# Altium project REGENIX (1).PrjPCB (part 2 of 2)

## Sheet REGENIX_Relais_24V_1.SchDoc
size Tabloid; Date: Date; Author: Author 1; DocumentNumber: 2; Revision: 1; SheetNumber: 14; SheetTotal: 17; Size: 11x17; Sheet_Name: BATTERY PROTECTION & AUXILIARY
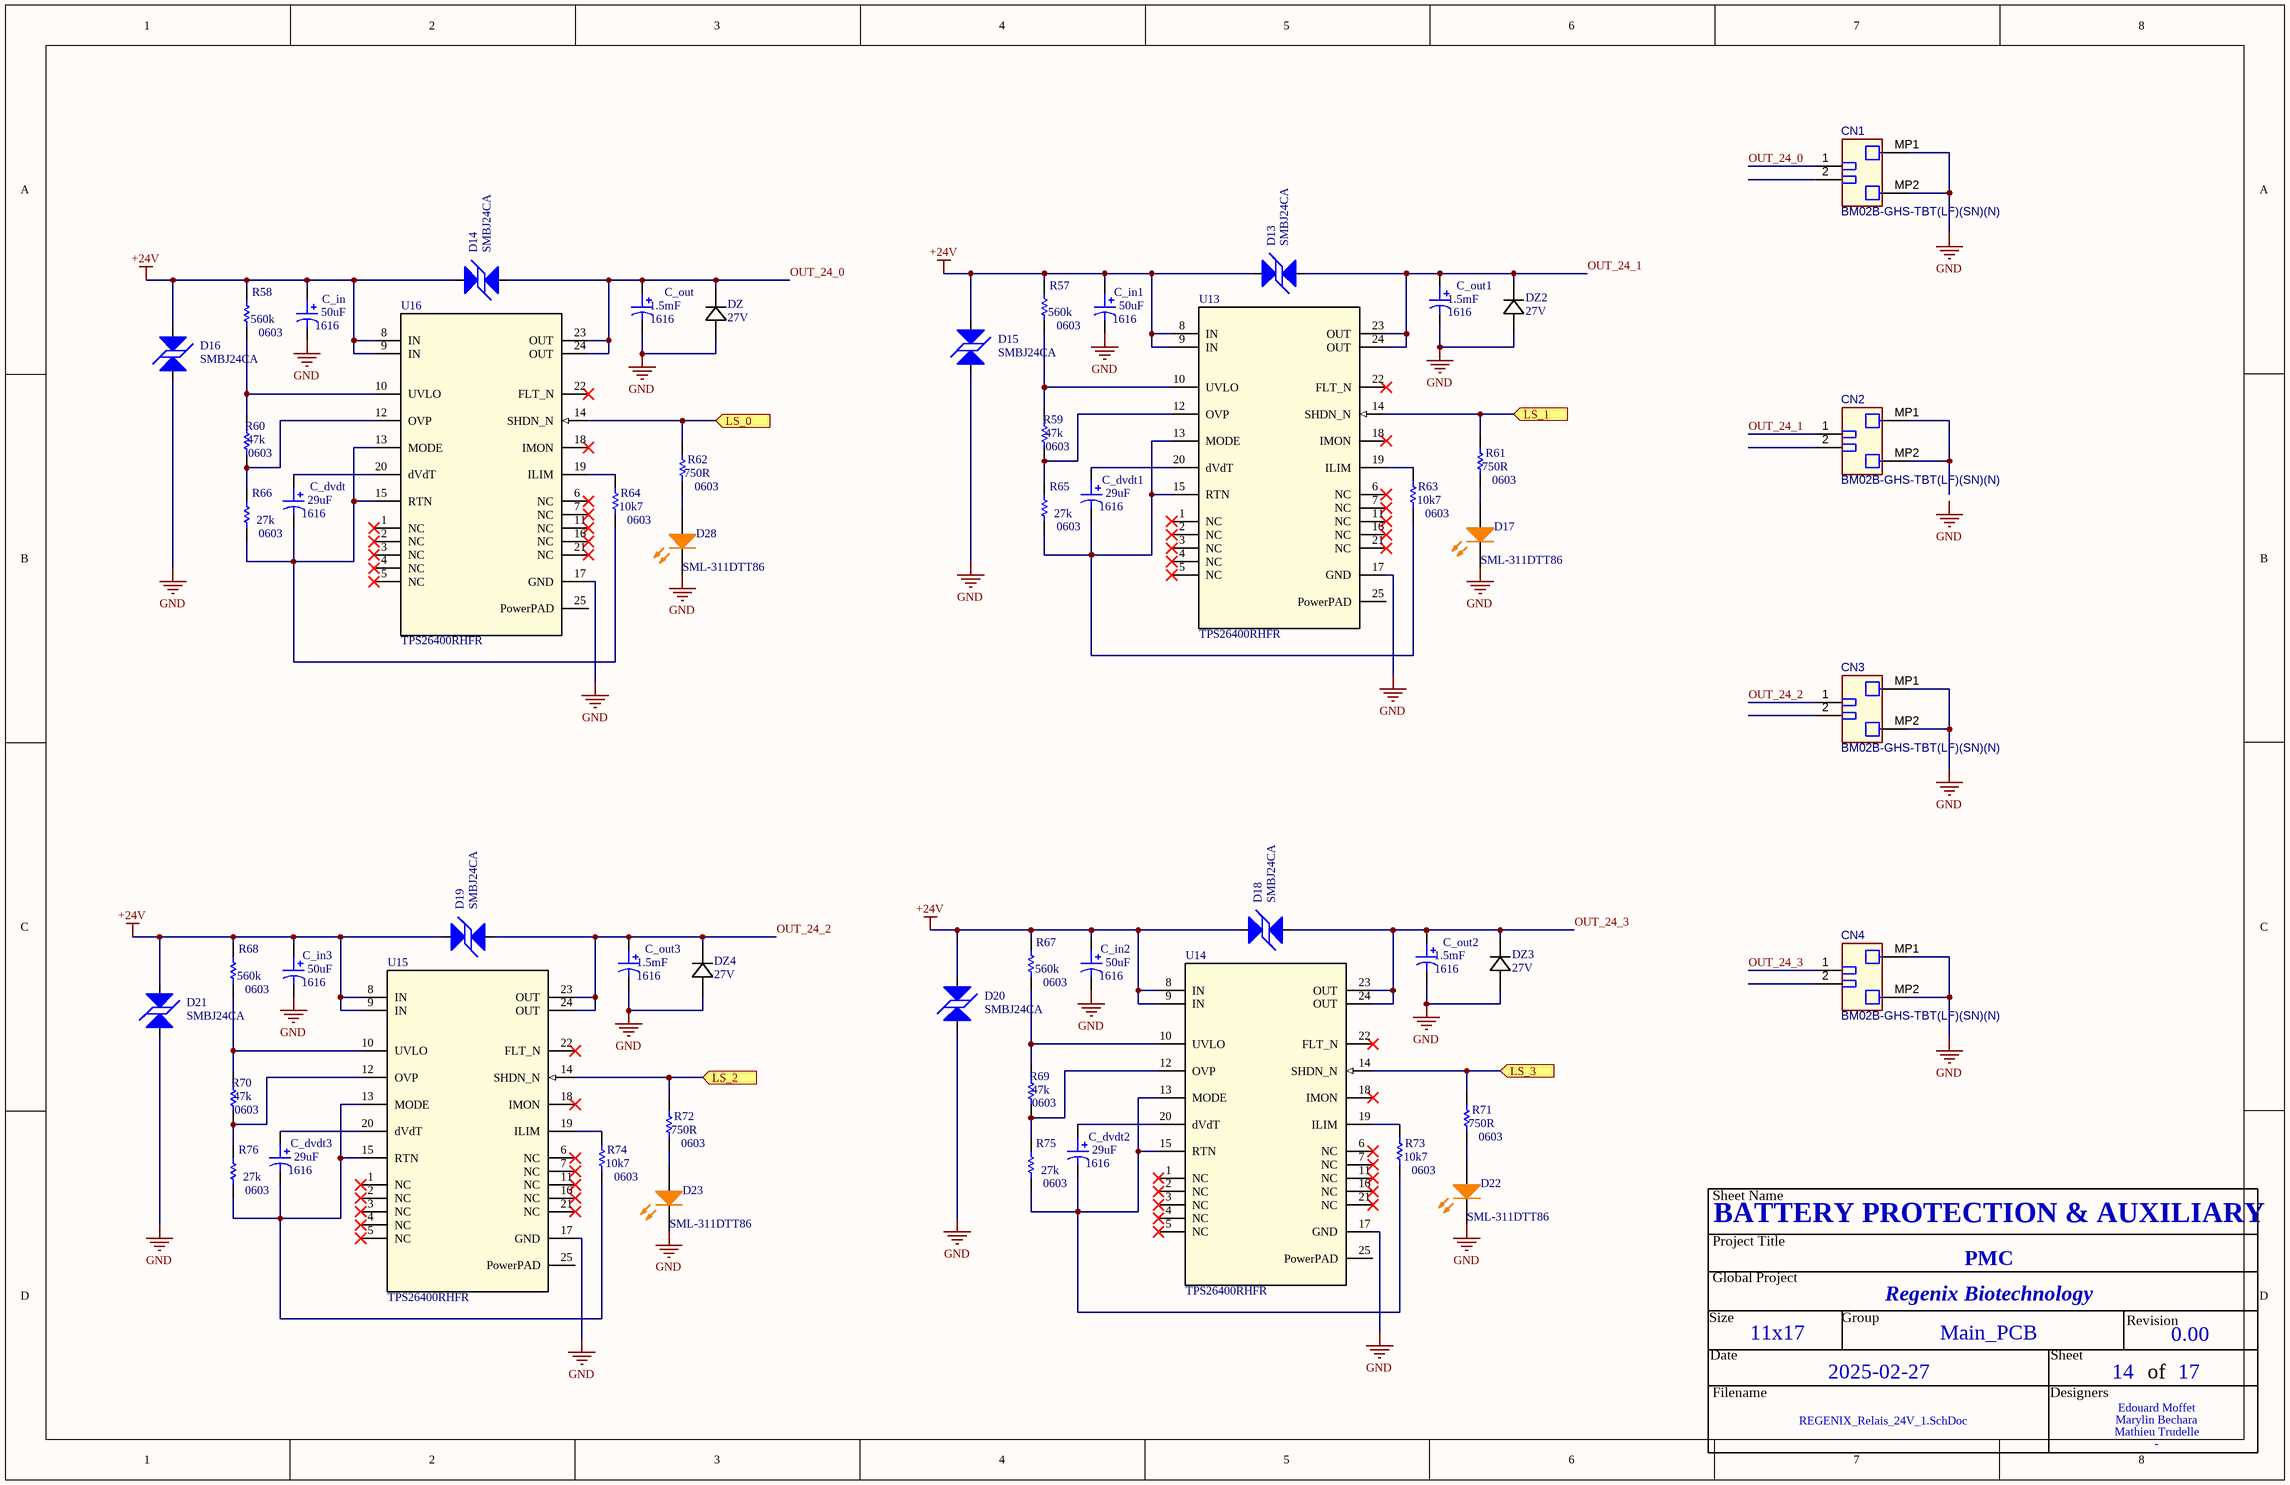
[diagram p11: REGENIX_Relais_24V_1.SchDoc]

### Parts
(Parts that share a designator on the sheet are numbered #1, #2 ... from top to bottom, then left to right.)
C_dvdt1  value 29uF  Package: 1616  [CAP_ALU_1616_vishay]  (hidden comment: MAL214699108E3)
C_dvdt2  value 29uF  Package: 1616  [CAP_ALU_1616_vishay]  (hidden comment: MAL214699108E3)
C_dvdt3  value 29uF  Package: 1616  [CAP_ALU_1616_vishay]  (hidden comment: MAL214699108E3)
C_dvdt#2  value 29uF  Package: 1616  [CAP_ALU_1616_vishay]  (hidden comment: MAL214699108E3)
C_in1  value 50uF  Package: 1616  [CAP_ALU_1616_vishay]  (hidden comment: MAL214699108E3)
C_in2  value 50uF  Package: 1616  [CAP_ALU_1616_vishay]  (hidden comment: MAL214699108E3)
C_in3  value 50uF  Package: 1616  [CAP_ALU_1616_vishay]  (hidden comment: MAL214699108E3)
C_in#2  value 50uF  Package: 1616  [CAP_ALU_1616_vishay]  (hidden comment: MAL214699108E3)
C_out1  value 1.5mF  Package: 1616  [CAP_ALU_1616_vishay]  (hidden comment: MAL214699108E3)
C_out2  value 1.5mF  Package: 1616  [CAP_ALU_1616_vishay]  (hidden comment: MAL214699108E3)
C_out3  value 1.5mF  Package: 1616  [CAP_ALU_1616_vishay]  (hidden comment: MAL214699108E3)
C_out#2  value 1.5mF  Package: 1616  [CAP_ALU_1616_vishay]  (hidden comment: MAL214699108E3)
CN1  BM02B-GHS-TBT(LF)(SN)(N)  [JST-BM02B-GHS-TBT_V]
CN2  BM02B-GHS-TBT(LF)(SN)(N)  [JST-BM02B-GHS-TBT_V]
CN3  BM02B-GHS-TBT(LF)(SN)(N)  [JST-BM02B-GHS-TBT_V]
CN4  BM02B-GHS-TBT(LF)(SN)(N)  [JST-BM02B-GHS-TBT_V]
D13  SMBJ24CA  [TVS_PWR_SMBJ36CA]
D14  SMBJ24CA  [TVS_PWR_SMBJ36CA]
D15  SMBJ24CA  [TVS_PWR_SMBJ36CA]
D16  SMBJ24CA  [TVS_PWR_SMBJ36CA]
D17  SML-311DTT86  [LED_0603]
D18  SMBJ24CA  [TVS_PWR_SMBJ36CA]
D19  SMBJ24CA  [TVS_PWR_SMBJ36CA]
D20  SMBJ24CA  [TVS_PWR_SMBJ36CA]
D21  SMBJ24CA  [TVS_PWR_SMBJ36CA]
D22  SML-311DTT86  [LED_0603]
D23  SML-311DTT86  [LED_0603]
D28#2  SML-311DTT86  [LED_0603]
DZ2  27V  [SOD123_DIO]
DZ3  27V  [SOD123_DIO]
DZ4  27V  [SOD123_DIO]
DZ#2  27V  [SOD123_DIO]
R57  Package: 0603  Precision: 560k  [RES_0603]  (hidden comment: RES - 0603)
R58  Package: 0603  Precision: 560k  [RES_0603]  (hidden comment: RES - 0603)
R59  Package: 0603  Precision: 47k  [RES_0603]  (hidden comment: RES - 0603)
R60  Package: 0603  Precision: 47k  [RES_0603]  (hidden comment: RES - 0603)
R61  Package: 0603  Precision: 750R  [RES_0603]  (hidden comment: RES - 0603)
R62  Package: 0603  Precision: 750R  [RES_0603]  (hidden comment: RES - 0603)
R63  Package: 0603  Precision: 10k7  [RES_0603]  (hidden comment: RES - 0603)
R64  Package: 0603  Precision: 10k7  [RES_0603]  (hidden comment: RES - 0603)
R65  Package: 0603  Precision: 27k  [RES_0603]  (hidden comment: RES - 0603)
R66  Package: 0603  Precision: 27k  [RES_0603]  (hidden comment: RES - 0603)
R67  Package: 0603  Precision: 560k  [RES_0603]  (hidden comment: RES - 0603)
R68  Package: 0603  Precision: 560k  [RES_0603]  (hidden comment: RES - 0603)
R69  Package: 0603  Precision: 47k  [RES_0603]  (hidden comment: RES - 0603)
R70  Package: 0603  Precision: 47k  [RES_0603]  (hidden comment: RES - 0603)
R71  Package: 0603  Precision: 750R  [RES_0603]  (hidden comment: RES - 0603)
R72  Package: 0603  Precision: 750R  [RES_0603]  (hidden comment: RES - 0603)
R73  Package: 0603  Precision: 10k7  [RES_0603]  (hidden comment: RES - 0603)
R74  Package: 0603  Precision: 10k7  [RES_0603]  (hidden comment: RES - 0603)
R75  Package: 0603  Precision: 27k  [RES_0603]  (hidden comment: RES - 0603)
R76  Package: 0603  Precision: 27k  [RES_0603]  (hidden comment: RES - 0603)
U13  TPS26400RHFR  [RHF0024A-IPC_A]
U14  TPS26400RHFR  [RHF0024A-IPC_A]
U15  TPS26400RHFR  [RHF0024A-IPC_A]
U16#2  TPS26400RHFR  [RHF0024A-IPC_A]

### Ports
LS_0 (in), LS_1 (in), LS_2 (in), LS_3 (in)

### Nets
+24V: C_in1.1 C_in2.1 C_in3.1 C_in#2.1 D13.1 D14.1 D15.1 D16.1 D18.1 D19.1 D20.1 D21.1 R57.2 R58.2 R67.2 R68.2 U13.8(IN) U13.9(IN) U14.8(IN) U14.9(IN) U15.8(IN) U15.9(IN) U16#2.8(IN) U16#2.9(IN)
GND: C_in1.2 C_in2.2 C_in3.2 C_in#2.2 C_out1.2 C_out2.2 C_out3.2 C_out#2.2 CN1.MP1 CN1.MP2 CN3.MP1 CN3.MP2 CN4.MP1 CN4.MP2 D15.2 D16.2 D17.K D20.2 D21.2 D22.K D23.K D28#2.K DZ2.2 DZ3.2 DZ4.2 DZ#2.2 U13.17(GND) U14.17(GND) U15.17(GND) U16#2.17(GND)
LS_0: R62.2 U16#2.14(SHDN_N) ; port LS_0
LS_1: R61.2 U13.14(SHDN_N) ; port LS_1
LS_2: R72.2 U15.14(SHDN_N) ; port LS_2
LS_3: R71.2 U14.14(SHDN_N) ; port LS_3
OUT_24_0: C_out#2.1 CN1.1 D14.2 DZ#2.1 U16#2.23(OUT) U16#2.24(OUT)
OUT_24_1: C_out1.1 CN2.1 D13.2 DZ2.1 U13.23(OUT) U13.24(OUT)
OUT_24_2: C_out3.1 CN3.1 D19.2 DZ4.1 U15.23(OUT) U15.24(OUT)
OUT_24_3: C_out2.1 CN4.1 D18.2 DZ3.1 U14.23(OUT) U14.24(OUT)
NetC_dvdt1_1: C_dvdt1.1 U13.20(dVdT)
NetC_dvdt1_2: C_dvdt1.2 R63.1 R65.1 U13.13(MODE) U13.15(RTN)
NetC_dvdt2_1: C_dvdt2.1 U14.20(dVdT)
NetC_dvdt2_2: C_dvdt2.2 R73.1 R75.1 U14.13(MODE) U14.15(RTN)
NetC_dvdt3_1: C_dvdt3.1 U15.20(dVdT)
NetC_dvdt3_2: C_dvdt3.2 R74.1 R76.1 U15.13(MODE) U15.15(RTN)
NetC_dvdt#2_1: C_dvdt#2.1 U16#2.20(dVdT)
NetC_dvdt#2_2: C_dvdt#2.2 R64.1 R66.1 U16#2.13(MODE) U16#2.15(RTN)
NetCN2_MP1: CN2.MP1 CN2.MP2
NetD17_A: D17.A R61.1
NetD22_A: D22.A R71.1
NetD23_A: D23.A R72.1
NetD28#2_A: D28#2.A R62.1
NetR57_1: R57.1 R59.2 U13.10(UVLO)
NetR58_1: R58.1 R60.2 U16#2.10(UVLO)
NetR59_1: R59.1 R65.2 U13.12(OVP)
NetR60_1: R60.1 R66.2 U16#2.12(OVP)
NetR63_2: R63.2 U13.19(ILIM)
NetR64_2: R64.2 U16#2.19(ILIM)
NetR67_1: R67.1 R69.2 U14.10(UVLO)
NetR68_1: R68.1 R70.2 U15.10(UVLO)
NetR69_1: R69.1 R75.2 U14.12(OVP)
NetR70_1: R70.1 R76.2 U15.12(OVP)
NetR73_2: R73.2 U14.19(ILIM)
NetR74_2: R74.2 U15.19(ILIM)

Not connected (* = marked no-connect by the designer): CN1 2; CN2 2; CN3 2; CN4 2; U13 1(NC)* 2(NC)* 3(NC)* 4(NC)* 5(NC)* 6(NC)* 7(NC)* 11(NC)* 16(NC)* 18(IMON)* 21(NC)* 22(FLT_N)* 25(PowerPAD); U14 1(NC)* 2(NC)* 3(NC)* 4(NC)* 5(NC)* 6(NC)* 7(NC)* 11(NC)* 16(NC)* 18(IMON)* 21(NC)* 22(FLT_N)* 25(PowerPAD); U15 1(NC)* 2(NC)* 3(NC)* 4(NC)* 5(NC)* 6(NC)* 7(NC)* 11(NC)* 16(NC)* 18(IMON)* 21(NC)* 22(FLT_N)* 25(PowerPAD); U16#2 1(NC)* 2(NC)* 3(NC)* 4(NC)* 5(NC)* 6(NC)* 7(NC)* 11(NC)* 16(NC)* 18(IMON)* 21(NC)* 22(FLT_N)* 25(PowerPAD)

### Notes on the sheet
- Labels drawn without touching a wire or pin: GND
- Sheet Name
- Project Title
- Global Project
- Revision
- Size
- Date
- Group
- Sheet
- of
- Filename
- Designers

### Library data of the parts
C_dvdt1-C_dvdt3 C_dvdt#2 C_in1-C_in3 C_in#2 C_out1-C_out3 C_out#2 = CAP_ALU_MAL214699108E3: as C240 on sheet REGENIX_Battery_Protection; Mfg Part Number: MAL214699108E3; HelpURL: http://www.vishay.com/docs/28403/146cti.pdf; CreatedBy: Jonathan Bouchard; Temperature: -55°C to 125°C; Power: *; Supplier 1: Digikey; Supplier Part Number 1: 4442PHCT-ND
CN1-CN4 = CMP-002-00061-3: Disconnectable Crimp Style Connector, Pitch 1.25 mm, 1 x 2 Position, Height 4.05 mm, -25 to 85 degC, RoHS, Tape and Reel; Connector Type: Header,Shrouded; Mounting Technology: SurfaceMount; Case/Package: Disconnectable Crimp Style Connector, Pitch 1.25 mm, 1 x 2 Position, Height 4.05 mm; Pins: 4
D13-D16 D18-D21 = TVS_PWR_SMBJ24CA: as D8 on sheet REGENIX_Battery_Protection; Tolerance: *; Power Max: 600W; HelpURL: http://www.littelfuse.com/~/media/electronics/datasheets/tvs_diodes/littelfuse_tvs_diode_smbj_datasheet.pdf.pdf; CreatedBy/Date: Arnaud Samson - 06/07/18; VerifiedBy: Jonathan Bouchard - 2018-07-13; Temperature: -65°C ~ 150°C (TJ); Package: DO214AA; Manufacturer #2: *; Note: *; Assembly Type: SMD; Part Number #2: *; Part Number #1: SMBJ24CA; Supplier 1: Digi-Key; Supplier Part Number 1: SMBJ24CALFCT-ND; Cryo: UNKNOWN
D17 D22 D23 D28#2 = LED_SML-311DTT86: as D26 on sheet REGENIX_Relais_12V; Current: 2mA; HelpURL: http://media.digikey.com/pdf/Data%20Sheets/Rohm%20PDFs/SML-311%20Series.pdf; CreatedBy: Jonathan Bouchard; Temperature: -40°C to 85°C; Package: 0603; Precision: *; Mfg Part Number: SML-311DTT86; Supplier 1: Digikey; Supplier Part Number 1: 511-1303-1-ND
DZ2-DZ4 DZ#2 = MMSZ5254B-7-F: as DZ#1 on sheet REGENIX_Relais_12V
U13-U15 U16#2 = TPS26400RHFR: as U16#1 on sheet REGENIX_Relais_12V; TYPE: TYPE; RefDes: RefDes
R57-R76 = RES - 0603: Current: *; CreatedBy: Jonathan Bouchard

## Sheet REGENIX_Relais_24V_2.SchDoc
size Tabloid; Date: Date; Author: Author 1; DocumentNumber: 2; Revision: 1; SheetNumber: 15; SheetTotal: 17; Size: 11x17; Sheet_Name: BATTERY PROTECTION & AUXILIARY
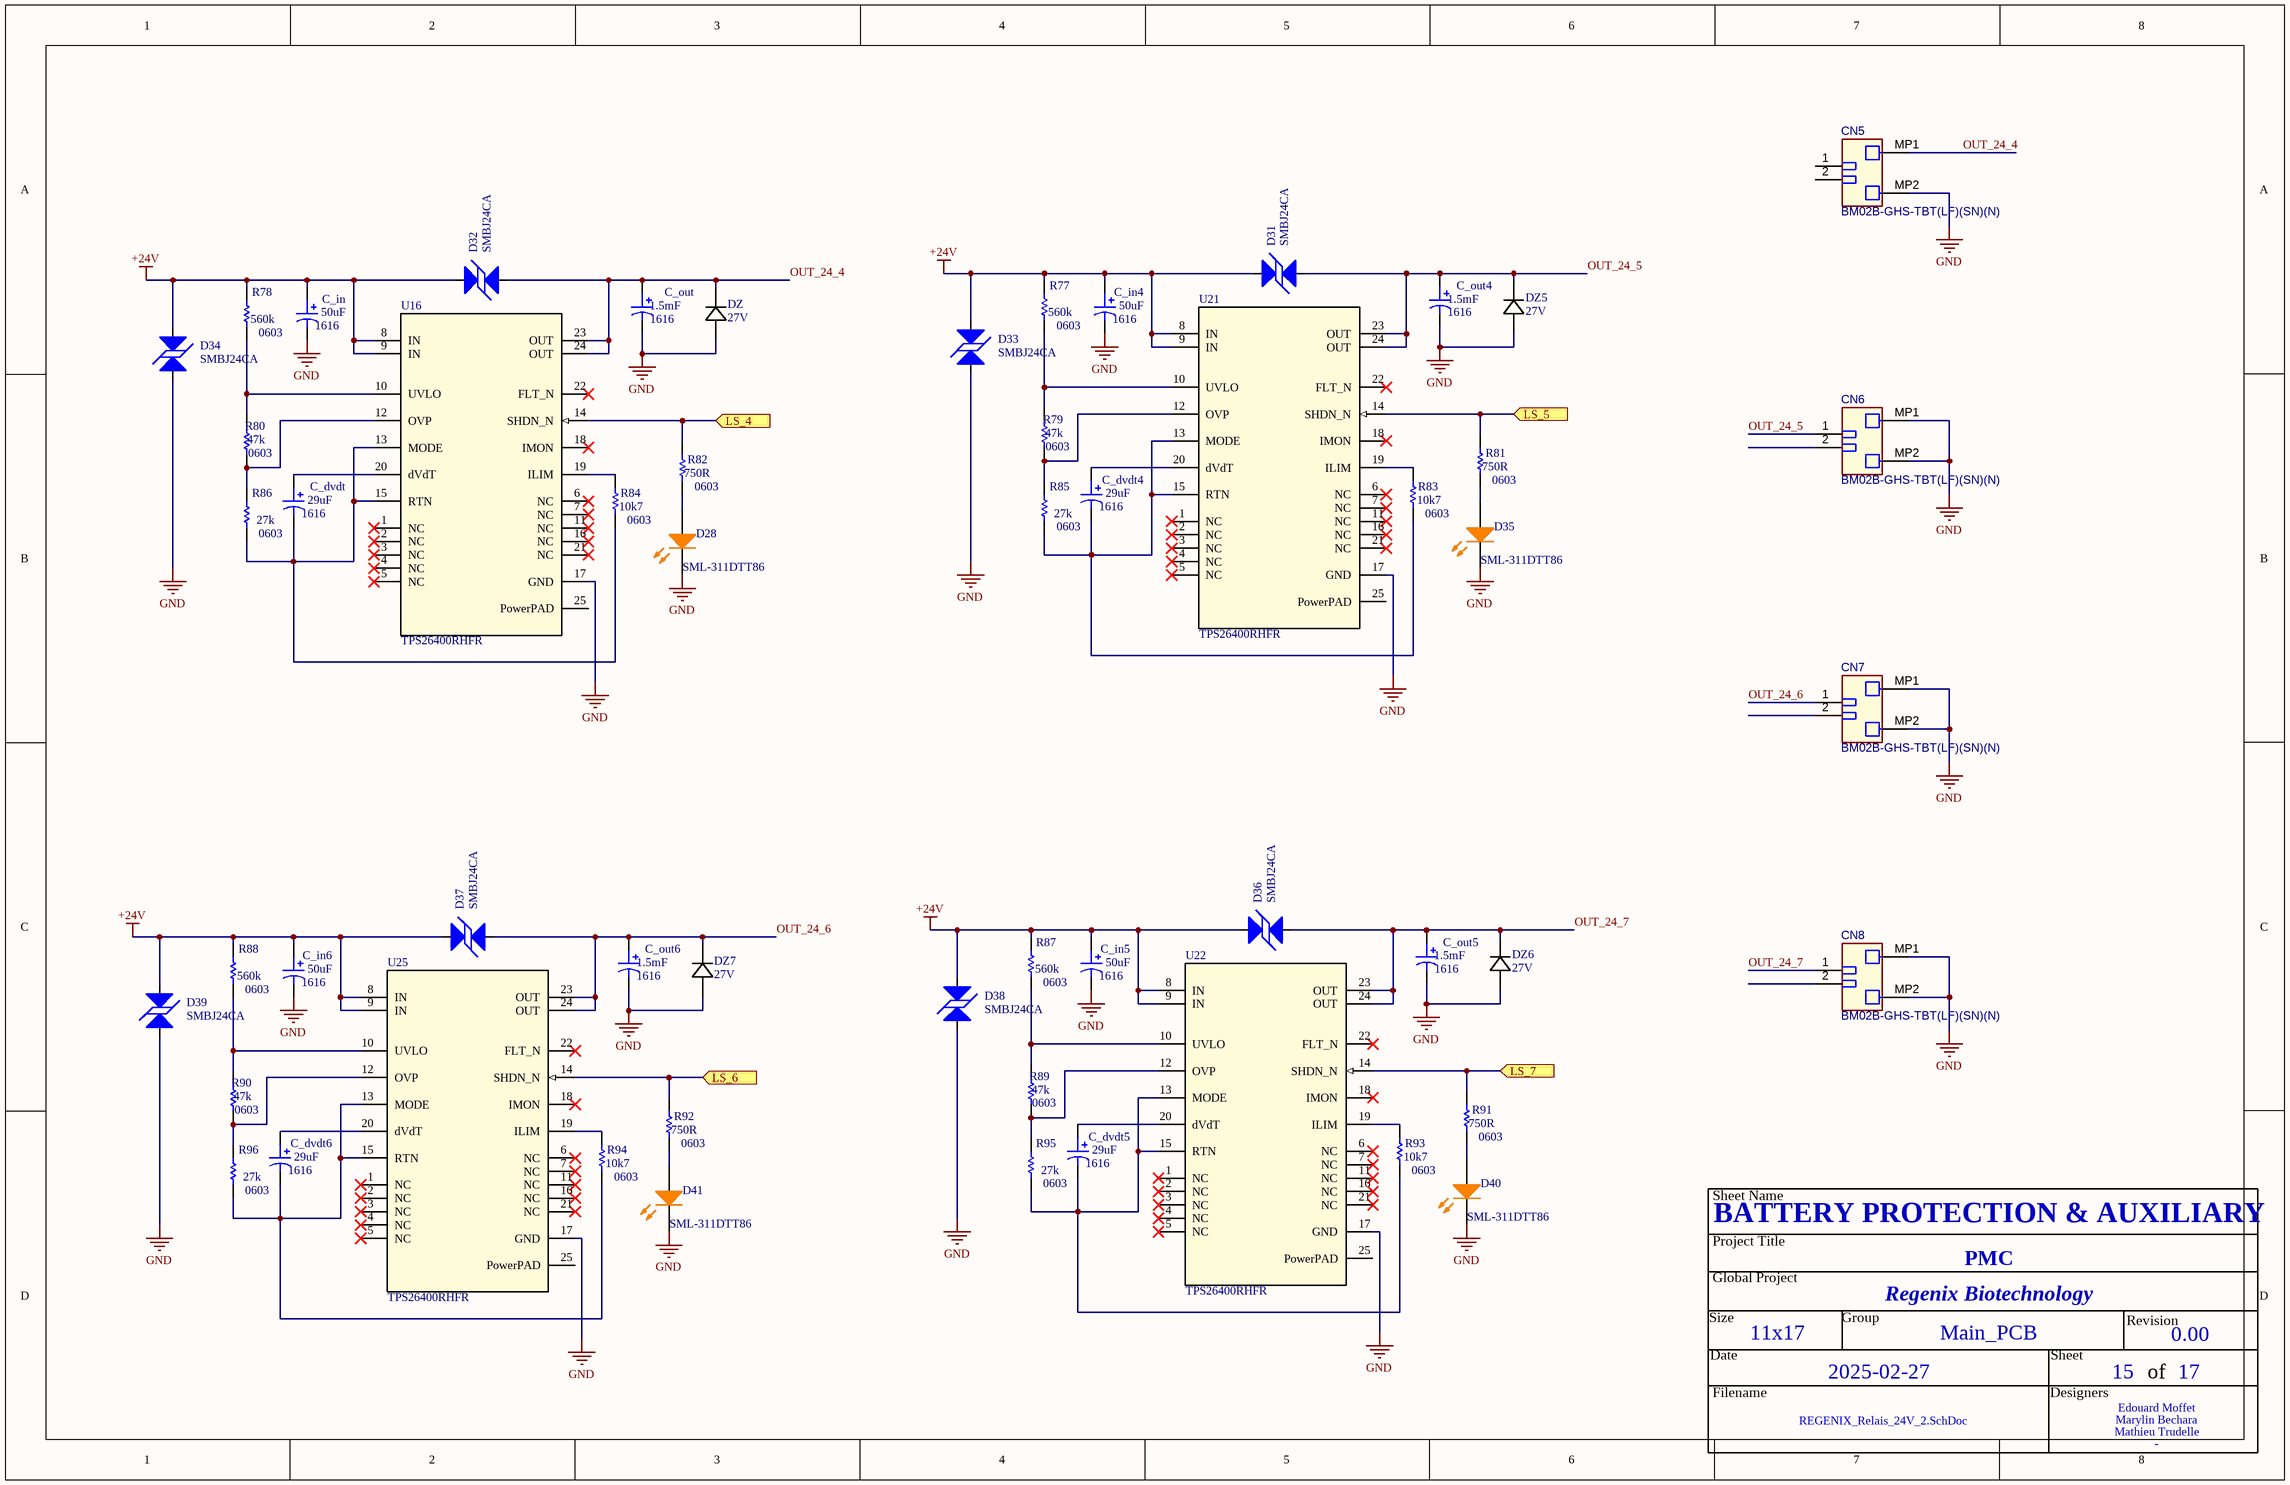
[diagram p12: REGENIX_Relais_24V_2.SchDoc]

### Parts
(Parts that share a designator on the sheet are numbered #1, #2 ... from top to bottom, then left to right.)
C_dvdt4  value 29uF  Package: 1616  [CAP_ALU_1616_vishay]  (hidden comment: MAL214699108E3)
C_dvdt5  value 29uF  Package: 1616  [CAP_ALU_1616_vishay]  (hidden comment: MAL214699108E3)
C_dvdt6  value 29uF  Package: 1616  [CAP_ALU_1616_vishay]  (hidden comment: MAL214699108E3)
C_dvdt#3  value 29uF  Package: 1616  [CAP_ALU_1616_vishay]  (hidden comment: MAL214699108E3)
C_in4  value 50uF  Package: 1616  [CAP_ALU_1616_vishay]  (hidden comment: MAL214699108E3)
C_in5  value 50uF  Package: 1616  [CAP_ALU_1616_vishay]  (hidden comment: MAL214699108E3)
C_in6  value 50uF  Package: 1616  [CAP_ALU_1616_vishay]  (hidden comment: MAL214699108E3)
C_in#3  value 50uF  Package: 1616  [CAP_ALU_1616_vishay]  (hidden comment: MAL214699108E3)
C_out4  value 1.5mF  Package: 1616  [CAP_ALU_1616_vishay]  (hidden comment: MAL214699108E3)
C_out5  value 1.5mF  Package: 1616  [CAP_ALU_1616_vishay]  (hidden comment: MAL214699108E3)
C_out6  value 1.5mF  Package: 1616  [CAP_ALU_1616_vishay]  (hidden comment: MAL214699108E3)
C_out#3  value 1.5mF  Package: 1616  [CAP_ALU_1616_vishay]  (hidden comment: MAL214699108E3)
CN5  BM02B-GHS-TBT(LF)(SN)(N)  [JST-BM02B-GHS-TBT_V]
CN6  BM02B-GHS-TBT(LF)(SN)(N)  [JST-BM02B-GHS-TBT_V]
CN7  BM02B-GHS-TBT(LF)(SN)(N)  [JST-BM02B-GHS-TBT_V]
CN8  BM02B-GHS-TBT(LF)(SN)(N)  [JST-BM02B-GHS-TBT_V]
D28#3  SML-311DTT86  [LED_0603]
D31  SMBJ24CA  [TVS_PWR_SMBJ36CA]
D32  SMBJ24CA  [TVS_PWR_SMBJ36CA]
D33  SMBJ24CA  [TVS_PWR_SMBJ36CA]
D34  SMBJ24CA  [TVS_PWR_SMBJ36CA]
D35  SML-311DTT86  [LED_0603]
D36  SMBJ24CA  [TVS_PWR_SMBJ36CA]
D37  SMBJ24CA  [TVS_PWR_SMBJ36CA]
D38  SMBJ24CA  [TVS_PWR_SMBJ36CA]
D39  SMBJ24CA  [TVS_PWR_SMBJ36CA]
D40  SML-311DTT86  [LED_0603]
D41  SML-311DTT86  [LED_0603]
DZ5  27V  [SOD123_DIO]
DZ6  27V  [SOD123_DIO]
DZ7  27V  [SOD123_DIO]
DZ#3  27V  [SOD123_DIO]
R77  Package: 0603  Precision: 560k  [RES_0603]  (hidden comment: RES - 0603)
R78  Package: 0603  Precision: 560k  [RES_0603]  (hidden comment: RES - 0603)
R79  Package: 0603  Precision: 47k  [RES_0603]  (hidden comment: RES - 0603)
R80  Package: 0603  Precision: 47k  [RES_0603]  (hidden comment: RES - 0603)
R81  Package: 0603  Precision: 750R  [RES_0603]  (hidden comment: RES - 0603)
R82  Package: 0603  Precision: 750R  [RES_0603]  (hidden comment: RES - 0603)
R83  Package: 0603  Precision: 10k7  [RES_0603]  (hidden comment: RES - 0603)
R84  Package: 0603  Precision: 10k7  [RES_0603]  (hidden comment: RES - 0603)
R85  Package: 0603  Precision: 27k  [RES_0603]  (hidden comment: RES - 0603)
R86  Package: 0603  Precision: 27k  [RES_0603]  (hidden comment: RES - 0603)
R87  Package: 0603  Precision: 560k  [RES_0603]  (hidden comment: RES - 0603)
R88  Package: 0603  Precision: 560k  [RES_0603]  (hidden comment: RES - 0603)
R89  Package: 0603  Precision: 47k  [RES_0603]  (hidden comment: RES - 0603)
R90  Package: 0603  Precision: 47k  [RES_0603]  (hidden comment: RES - 0603)
R91  Package: 0603  Precision: 750R  [RES_0603]  (hidden comment: RES - 0603)
R92  Package: 0603  Precision: 750R  [RES_0603]  (hidden comment: RES - 0603)
R93  Package: 0603  Precision: 10k7  [RES_0603]  (hidden comment: RES - 0603)
R94  Package: 0603  Precision: 10k7  [RES_0603]  (hidden comment: RES - 0603)
R95  Package: 0603  Precision: 27k  [RES_0603]  (hidden comment: RES - 0603)
R96  Package: 0603  Precision: 27k  [RES_0603]  (hidden comment: RES - 0603)
U16#3  TPS26400RHFR  [RHF0024A-IPC_A]
U21  TPS26400RHFR  [RHF0024A-IPC_A]
U22  TPS26400RHFR  [RHF0024A-IPC_A]
U25  TPS26400RHFR  [RHF0024A-IPC_A]

### Ports
LS_4 (in), LS_5 (in), LS_6 (in), LS_7 (in)

### Nets
+24V: C_in4.1 C_in5.1 C_in6.1 C_in#3.1 D31.1 D32.1 D33.1 D34.1 D36.1 D37.1 D38.1 D39.1 R77.2 R78.2 R87.2 R88.2 U16#3.8(IN) U16#3.9(IN) U21.8(IN) U21.9(IN) U22.8(IN) U22.9(IN) U25.8(IN) U25.9(IN)
GND: C_in4.2 C_in5.2 C_in6.2 C_in#3.2 C_out4.2 C_out5.2 C_out6.2 C_out#3.2 CN5.MP2 CN6.MP1 CN6.MP2 CN7.MP1 CN7.MP2 CN8.MP1 CN8.MP2 D28#3.K D33.2 D34.2 D35.K D38.2 D39.2 D40.K D41.K DZ5.2 DZ6.2 DZ7.2 DZ#3.2 U16#3.17(GND) U21.17(GND) U22.17(GND) U25.17(GND)
LS_4: R82.2 U16#3.14(SHDN_N) ; port LS_4
LS_5: R81.2 U21.14(SHDN_N) ; port LS_5
LS_6: R92.2 U25.14(SHDN_N) ; port LS_6
LS_7: R91.2 U22.14(SHDN_N) ; port LS_7
OUT_24_4: C_out#3.1 CN5.MP1 D32.2 DZ#3.1 U16#3.23(OUT) U16#3.24(OUT)
OUT_24_5: C_out4.1 CN6.1 D31.2 DZ5.1 U21.23(OUT) U21.24(OUT)
OUT_24_6: C_out6.1 CN7.1 D37.2 DZ7.1 U25.23(OUT) U25.24(OUT)
OUT_24_7: C_out5.1 CN8.1 D36.2 DZ6.1 U22.23(OUT) U22.24(OUT)
NetC_dvdt4_1: C_dvdt4.1 U21.20(dVdT)
NetC_dvdt4_2: C_dvdt4.2 R83.1 R85.1 U21.13(MODE) U21.15(RTN)
NetC_dvdt5_1: C_dvdt5.1 U22.20(dVdT)
NetC_dvdt5_2: C_dvdt5.2 R93.1 R95.1 U22.13(MODE) U22.15(RTN)
NetC_dvdt6_1: C_dvdt6.1 U25.20(dVdT)
NetC_dvdt6_2: C_dvdt6.2 R94.1 R96.1 U25.13(MODE) U25.15(RTN)
NetC_dvdt#3_1: C_dvdt#3.1 U16#3.20(dVdT)
NetC_dvdt#3_2: C_dvdt#3.2 R84.1 R86.1 U16#3.13(MODE) U16#3.15(RTN)
NetD28#3_A: D28#3.A R82.1
NetD35_A: D35.A R81.1
NetD40_A: D40.A R91.1
NetD41_A: D41.A R92.1
NetR77_1: R77.1 R79.2 U21.10(UVLO)
NetR78_1: R78.1 R80.2 U16#3.10(UVLO)
NetR79_1: R79.1 R85.2 U21.12(OVP)
NetR80_1: R80.1 R86.2 U16#3.12(OVP)
NetR83_2: R83.2 U21.19(ILIM)
NetR84_2: R84.2 U16#3.19(ILIM)
NetR87_1: R87.1 R89.2 U22.10(UVLO)
NetR88_1: R88.1 R90.2 U25.10(UVLO)
NetR89_1: R89.1 R95.2 U22.12(OVP)
NetR90_1: R90.1 R96.2 U25.12(OVP)
NetR93_2: R93.2 U22.19(ILIM)
NetR94_2: R94.2 U25.19(ILIM)

Not connected (* = marked no-connect by the designer): CN5 1 2; CN6 2; CN7 2; CN8 2; U16#3 1(NC)* 2(NC)* 3(NC)* 4(NC)* 5(NC)* 6(NC)* 7(NC)* 11(NC)* 16(NC)* 18(IMON)* 21(NC)* 22(FLT_N)* 25(PowerPAD); U21 1(NC)* 2(NC)* 3(NC)* 4(NC)* 5(NC)* 6(NC)* 7(NC)* 11(NC)* 16(NC)* 18(IMON)* 21(NC)* 22(FLT_N)* 25(PowerPAD); U22 1(NC)* 2(NC)* 3(NC)* 4(NC)* 5(NC)* 6(NC)* 7(NC)* 11(NC)* 16(NC)* 18(IMON)* 21(NC)* 22(FLT_N)* 25(PowerPAD); U25 1(NC)* 2(NC)* 3(NC)* 4(NC)* 5(NC)* 6(NC)* 7(NC)* 11(NC)* 16(NC)* 18(IMON)* 21(NC)* 22(FLT_N)* 25(PowerPAD)

### Notes on the sheet
- Sheet Name
- Project Title
- Global Project
- Revision
- Size
- Date
- Group
- Sheet
- of
- Filename
- Designers

### Library data of the parts
C_dvdt4-C_dvdt6 C_dvdt#3 C_in4-C_in6 C_in#3 C_out4-C_out6 C_out#3 = CAP_ALU_MAL214699108E3: as C240 on sheet REGENIX_Battery_Protection; Mfg Part Number: MAL214699108E3; HelpURL: http://www.vishay.com/docs/28403/146cti.pdf; CreatedBy: Jonathan Bouchard; Temperature: -55°C to 125°C; Power: *; Supplier 1: Digikey; Supplier Part Number 1: 4442PHCT-ND
CN5-CN8 = CMP-002-00061-3: as CN1 on sheet REGENIX_Relais_24V_1; Mounting Technology: SurfaceMount; Case/Package: Disconnectable Crimp Style Connector, Pitch 1.25 mm, 1 x 2 Position, Height 4.05 mm; Pins: 4
D28#3 D35 D40 D41 = LED_SML-311DTT86: as D26 on sheet REGENIX_Relais_12V; Current: 2mA; HelpURL: http://media.digikey.com/pdf/Data%20Sheets/Rohm%20PDFs/SML-311%20Series.pdf; CreatedBy: Jonathan Bouchard; Temperature: -40°C to 85°C; Package: 0603; Precision: *; Mfg Part Number: SML-311DTT86; Supplier 1: Digikey; Supplier Part Number 1: 511-1303-1-ND
D31-D34 D36-D39 = TVS_PWR_SMBJ24CA: as D8 on sheet REGENIX_Battery_Protection; Tolerance: *; Power Max: 600W; HelpURL: http://www.littelfuse.com/~/media/electronics/datasheets/tvs_diodes/littelfuse_tvs_diode_smbj_datasheet.pdf.pdf; CreatedBy/Date: Arnaud Samson - 06/07/18; VerifiedBy: Jonathan Bouchard - 2018-07-13; Temperature: -65°C ~ 150°C (TJ); Package: DO214AA; Manufacturer #2: *; Note: *; Assembly Type: SMD; Part Number #2: *; Part Number #1: SMBJ24CA; Supplier 1: Digi-Key; Supplier Part Number 1: SMBJ24CALFCT-ND; Cryo: UNKNOWN
DZ5-DZ7 DZ#3 = MMSZ5254B-7-F: as DZ#1 on sheet REGENIX_Relais_12V
U16#3 U21 U22 U25 = TPS26400RHFR: as U16#1 on sheet REGENIX_Relais_12V; TYPE: TYPE; RefDes: RefDes
R77-R96 = RES - 0603: Current: *; CreatedBy: Jonathan Bouchard

## Sheet REGENIX_Relais_24V_3.SchDoc
size Tabloid; Date: Date; Author: Author 1; DocumentNumber: 2; Revision: 1; SheetNumber: 16; SheetTotal: 17; Size: 11x17; Sheet_Name: BATTERY PROTECTION & AUXILIARY
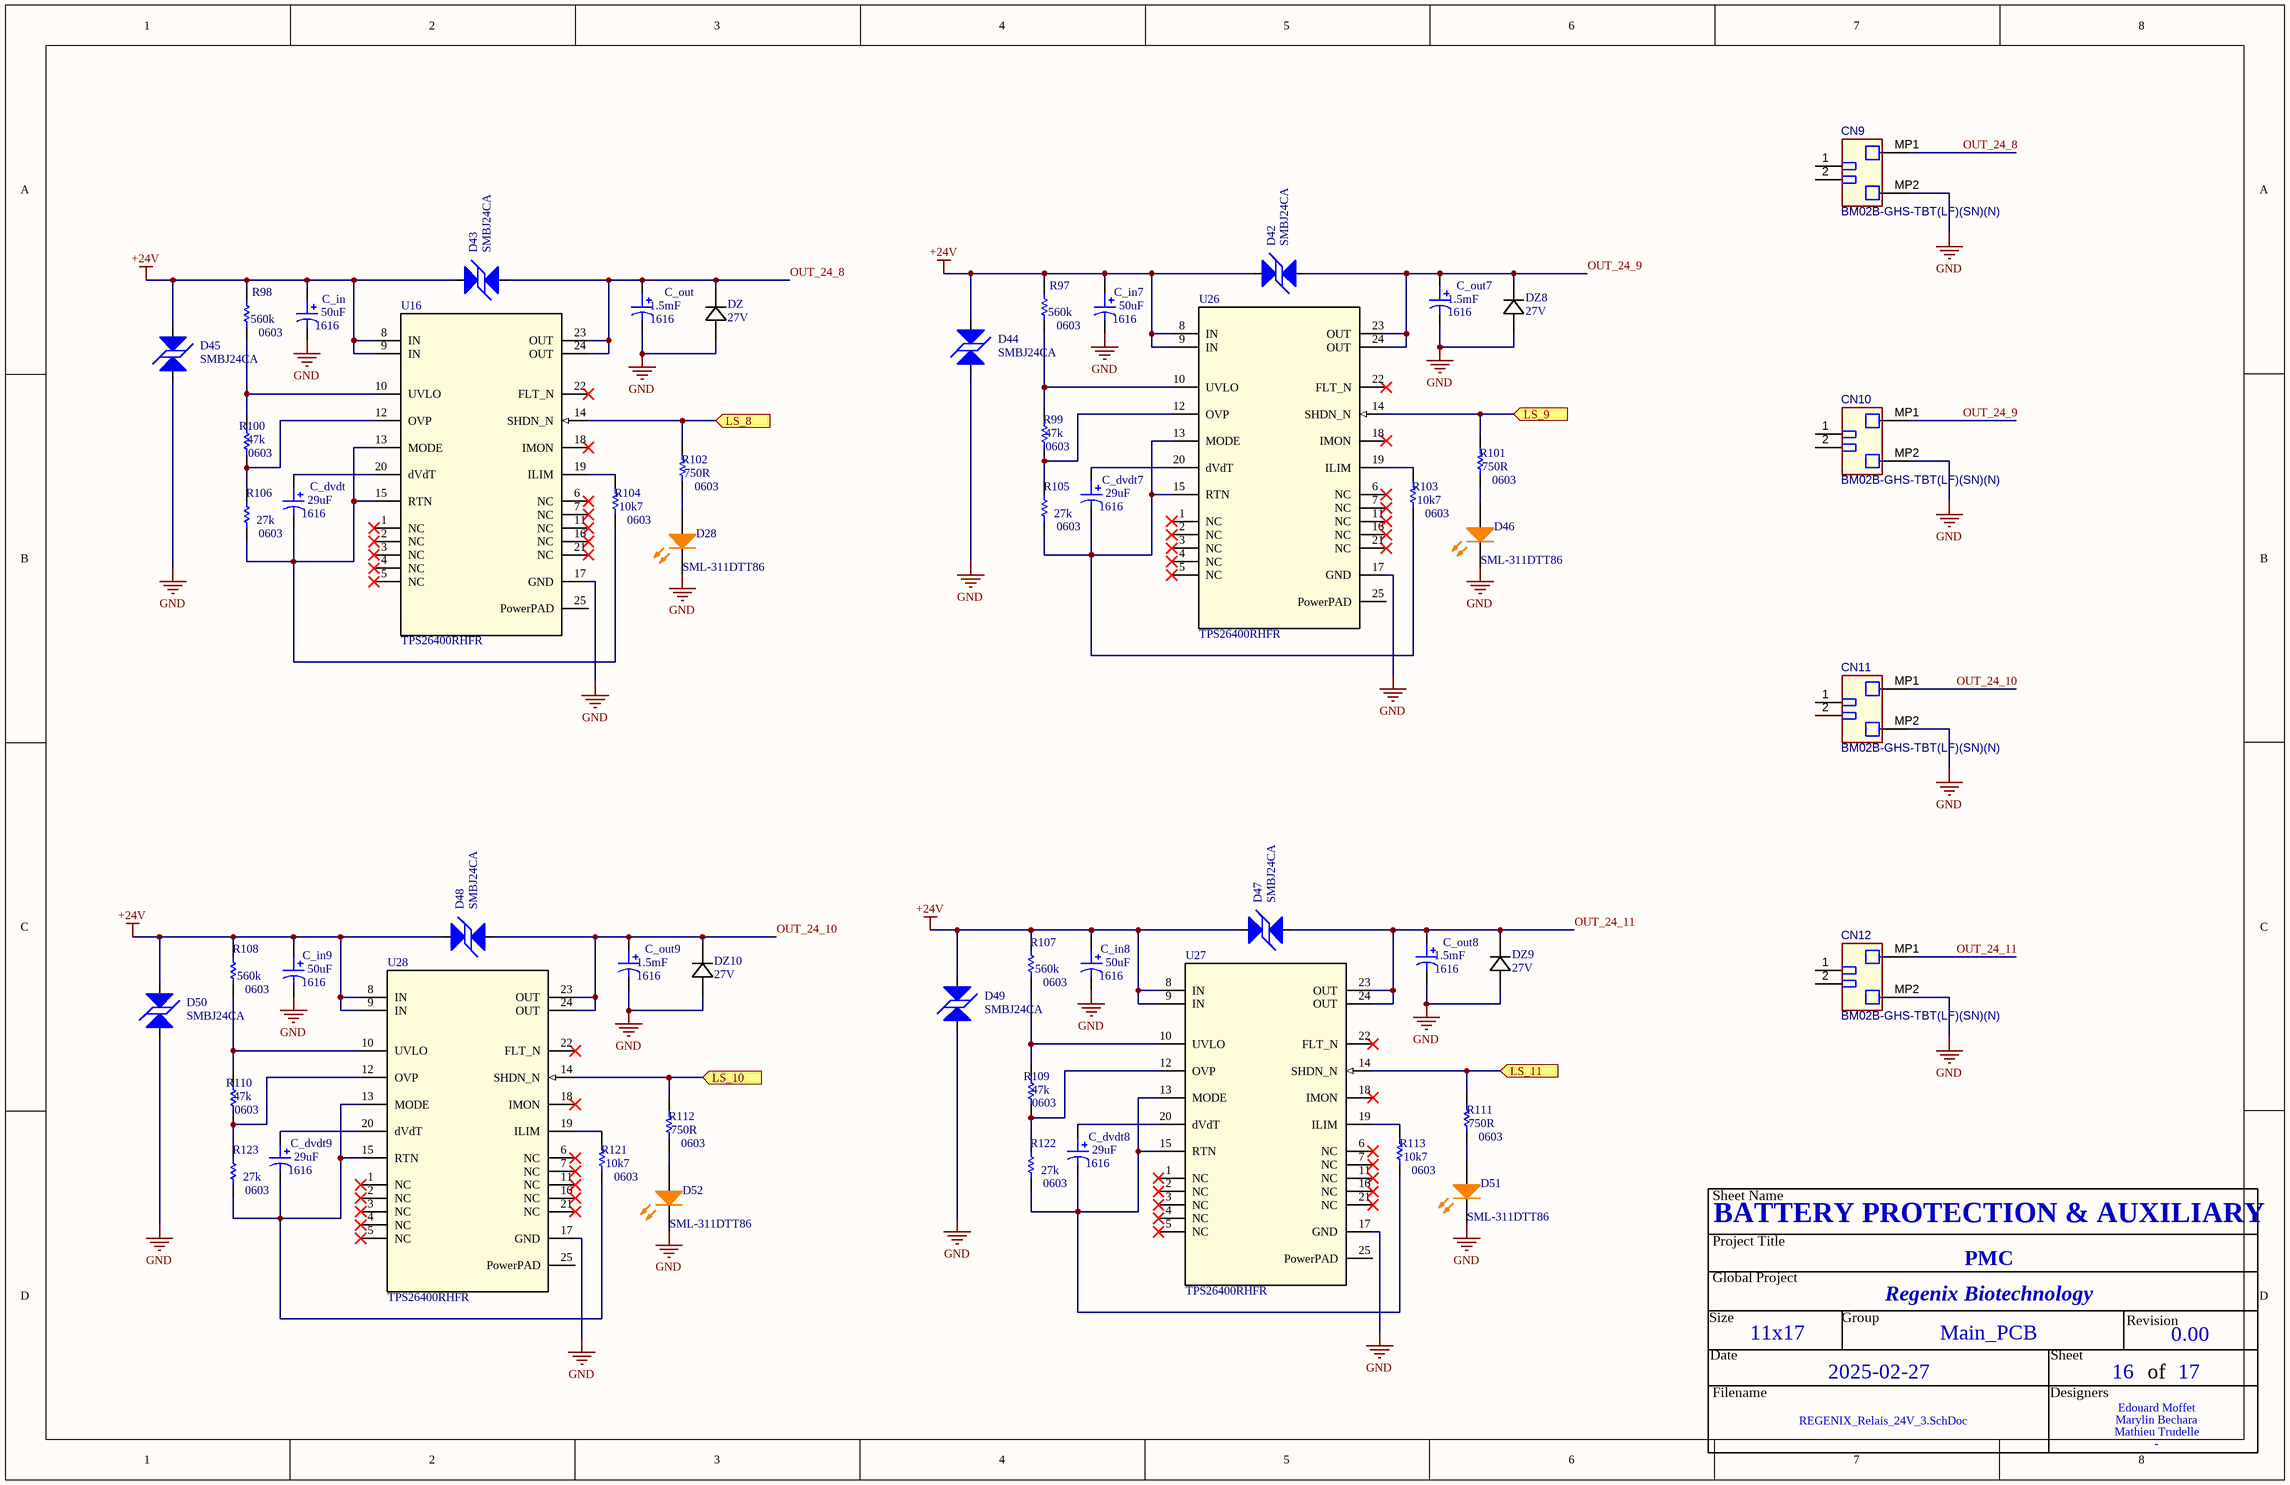
[diagram p13: REGENIX_Relais_24V_3.SchDoc]

### Parts
(Parts that share a designator on the sheet are numbered #1, #2 ... from top to bottom, then left to right.)
C_dvdt7  value 29uF  Package: 1616  [CAP_ALU_1616_vishay]  (hidden comment: MAL214699108E3)
C_dvdt8  value 29uF  Package: 1616  [CAP_ALU_1616_vishay]  (hidden comment: MAL214699108E3)
C_dvdt9  value 29uF  Package: 1616  [CAP_ALU_1616_vishay]  (hidden comment: MAL214699108E3)
C_dvdt#4  value 29uF  Package: 1616  [CAP_ALU_1616_vishay]  (hidden comment: MAL214699108E3)
C_in7  value 50uF  Package: 1616  [CAP_ALU_1616_vishay]  (hidden comment: MAL214699108E3)
C_in8  value 50uF  Package: 1616  [CAP_ALU_1616_vishay]  (hidden comment: MAL214699108E3)
C_in9  value 50uF  Package: 1616  [CAP_ALU_1616_vishay]  (hidden comment: MAL214699108E3)
C_in#4  value 50uF  Package: 1616  [CAP_ALU_1616_vishay]  (hidden comment: MAL214699108E3)
C_out7  value 1.5mF  Package: 1616  [CAP_ALU_1616_vishay]  (hidden comment: MAL214699108E3)
C_out8  value 1.5mF  Package: 1616  [CAP_ALU_1616_vishay]  (hidden comment: MAL214699108E3)
C_out9  value 1.5mF  Package: 1616  [CAP_ALU_1616_vishay]  (hidden comment: MAL214699108E3)
C_out#4  value 1.5mF  Package: 1616  [CAP_ALU_1616_vishay]  (hidden comment: MAL214699108E3)
CN9  BM02B-GHS-TBT(LF)(SN)(N)  [JST-BM02B-GHS-TBT_V]
CN10  BM02B-GHS-TBT(LF)(SN)(N)  [JST-BM02B-GHS-TBT_V]
CN11  BM02B-GHS-TBT(LF)(SN)(N)  [JST-BM02B-GHS-TBT_V]
CN12  BM02B-GHS-TBT(LF)(SN)(N)  [JST-BM02B-GHS-TBT_V]
D28#4  SML-311DTT86  [LED_0603]
D42  SMBJ24CA  [TVS_PWR_SMBJ36CA]
D43  SMBJ24CA  [TVS_PWR_SMBJ36CA]
D44  SMBJ24CA  [TVS_PWR_SMBJ36CA]
D45  SMBJ24CA  [TVS_PWR_SMBJ36CA]
D46  SML-311DTT86  [LED_0603]
D47  SMBJ24CA  [TVS_PWR_SMBJ36CA]
D48  SMBJ24CA  [TVS_PWR_SMBJ36CA]
D49  SMBJ24CA  [TVS_PWR_SMBJ36CA]
D50  SMBJ24CA  [TVS_PWR_SMBJ36CA]
D51  SML-311DTT86  [LED_0603]
D52  SML-311DTT86  [LED_0603]
DZ8  27V  [SOD123_DIO]
DZ9  27V  [SOD123_DIO]
DZ10  27V  [SOD123_DIO]
DZ#4  27V  [SOD123_DIO]
R97  Package: 0603  Precision: 560k  [RES_0603]  (hidden comment: RES - 0603)
R98  Package: 0603  Precision: 560k  [RES_0603]  (hidden comment: RES - 0603)
R99  Package: 0603  Precision: 47k  [RES_0603]  (hidden comment: RES - 0603)
R100  Package: 0603  Precision: 47k  [RES_0603]  (hidden comment: RES - 0603)
R101  Package: 0603  Precision: 750R  [RES_0603]  (hidden comment: RES - 0603)
R102  Package: 0603  Precision: 750R  [RES_0603]  (hidden comment: RES - 0603)
R103  Package: 0603  Precision: 10k7  [RES_0603]  (hidden comment: RES - 0603)
R104  Package: 0603  Precision: 10k7  [RES_0603]  (hidden comment: RES - 0603)
R105  Package: 0603  Precision: 27k  [RES_0603]  (hidden comment: RES - 0603)
R106  Package: 0603  Precision: 27k  [RES_0603]  (hidden comment: RES - 0603)
R107  Package: 0603  Precision: 560k  [RES_0603]  (hidden comment: RES - 0603)
R108  Package: 0603  Precision: 560k  [RES_0603]  (hidden comment: RES - 0603)
R109  Package: 0603  Precision: 47k  [RES_0603]  (hidden comment: RES - 0603)
R110  Package: 0603  Precision: 47k  [RES_0603]  (hidden comment: RES - 0603)
R111  Package: 0603  Precision: 750R  [RES_0603]  (hidden comment: RES - 0603)
R112  Package: 0603  Precision: 750R  [RES_0603]  (hidden comment: RES - 0603)
R113  Package: 0603  Precision: 10k7  [RES_0603]  (hidden comment: RES - 0603)
R121  Package: 0603  Precision: 10k7  [RES_0603]  (hidden comment: RES - 0603)
R122  Package: 0603  Precision: 27k  [RES_0603]  (hidden comment: RES - 0603)
R123  Package: 0603  Precision: 27k  [RES_0603]  (hidden comment: RES - 0603)
U16#4  TPS26400RHFR  [RHF0024A-IPC_A]
U26  TPS26400RHFR  [RHF0024A-IPC_A]
U27  TPS26400RHFR  [RHF0024A-IPC_A]
U28  TPS26400RHFR  [RHF0024A-IPC_A]

### Ports
LS_8 (in), LS_9 (in), LS_10 (in), LS_11 (in)

### Nets
+24V: C_in7.1 C_in8.1 C_in9.1 C_in#4.1 D42.1 D43.1 D44.1 D45.1 D47.1 D48.1 D49.1 D50.1 R97.2 R98.2 R107.2 R108.2 U16#4.8(IN) U16#4.9(IN) U26.8(IN) U26.9(IN) U27.8(IN) U27.9(IN) U28.8(IN) U28.9(IN)
GND: C_in7.2 C_in8.2 C_in9.2 C_in#4.2 C_out7.2 C_out8.2 C_out9.2 C_out#4.2 CN9.MP2 CN10.MP2 CN11.MP2 CN12.MP2 D28#4.K D44.2 D45.2 D46.K D49.2 D50.2 D51.K D52.K DZ8.2 DZ9.2 DZ10.2 DZ#4.2 U16#4.17(GND) U26.17(GND) U27.17(GND) U28.17(GND)
LS_8: R102.2 U16#4.14(SHDN_N) ; port LS_8
LS_9: R101.2 U26.14(SHDN_N) ; port LS_9
LS_10: R112.2 U28.14(SHDN_N) ; port LS_10
LS_11: R111.2 U27.14(SHDN_N) ; port LS_11
OUT_24_8: C_out#4.1 CN9.MP1 D43.2 DZ#4.1 U16#4.23(OUT) U16#4.24(OUT)
OUT_24_9: C_out7.1 CN10.MP1 D42.2 DZ8.1 U26.23(OUT) U26.24(OUT)
OUT_24_10: C_out9.1 CN11.MP1 D48.2 DZ10.1 U28.23(OUT) U28.24(OUT)
OUT_24_11: C_out8.1 CN12.MP1 D47.2 DZ9.1 U27.23(OUT) U27.24(OUT)
NetC_dvdt7_1: C_dvdt7.1 U26.20(dVdT)
NetC_dvdt7_2: C_dvdt7.2 R103.1 R105.1 U26.13(MODE) U26.15(RTN)
NetC_dvdt8_1: C_dvdt8.1 U27.20(dVdT)
NetC_dvdt8_2: C_dvdt8.2 R113.1 R122.1 U27.13(MODE) U27.15(RTN)
NetC_dvdt9_1: C_dvdt9.1 U28.20(dVdT)
NetC_dvdt9_2: C_dvdt9.2 R121.1 R123.1 U28.13(MODE) U28.15(RTN)
NetC_dvdt#4_1: C_dvdt#4.1 U16#4.20(dVdT)
NetC_dvdt#4_2: C_dvdt#4.2 R104.1 R106.1 U16#4.13(MODE) U16#4.15(RTN)
NetD28#4_A: D28#4.A R102.1
NetD46_A: D46.A R101.1
NetD51_A: D51.A R111.1
NetD52_A: D52.A R112.1
NetR97_1: R97.1 R99.2 U26.10(UVLO)
NetR98_1: R98.1 R100.2 U16#4.10(UVLO)
NetR99_1: R99.1 R105.2 U26.12(OVP)
NetR100_1: R100.1 R106.2 U16#4.12(OVP)
NetR103_2: R103.2 U26.19(ILIM)
NetR104_2: R104.2 U16#4.19(ILIM)
NetR107_1: R107.1 R109.2 U27.10(UVLO)
NetR108_1: R108.1 R110.2 U28.10(UVLO)
NetR109_1: R109.1 R122.2 U27.12(OVP)
NetR110_1: R110.1 R123.2 U28.12(OVP)
NetR113_2: R113.2 U27.19(ILIM)
NetR121_2: R121.2 U28.19(ILIM)

Not connected (* = marked no-connect by the designer): CN9 1 2; CN10 1 2; CN11 1 2; CN12 1 2; U16#4 1(NC)* 2(NC)* 3(NC)* 4(NC)* 5(NC)* 6(NC)* 7(NC)* 11(NC)* 16(NC)* 18(IMON)* 21(NC)* 22(FLT_N)* 25(PowerPAD); U26 1(NC)* 2(NC)* 3(NC)* 4(NC)* 5(NC)* 6(NC)* 7(NC)* 11(NC)* 16(NC)* 18(IMON)* 21(NC)* 22(FLT_N)* 25(PowerPAD); U27 1(NC)* 2(NC)* 3(NC)* 4(NC)* 5(NC)* 6(NC)* 7(NC)* 11(NC)* 16(NC)* 18(IMON)* 21(NC)* 22(FLT_N)* 25(PowerPAD); U28 1(NC)* 2(NC)* 3(NC)* 4(NC)* 5(NC)* 6(NC)* 7(NC)* 11(NC)* 16(NC)* 18(IMON)* 21(NC)* 22(FLT_N)* 25(PowerPAD)

### Notes on the sheet
- Sheet Name
- Project Title
- Global Project
- Revision
- Size
- Date
- Group
- Sheet
- of
- Filename
- Designers

### Library data of the parts
C_dvdt7-C_dvdt9 C_dvdt#4 C_in7-C_in9 C_in#4 C_out7-C_out9 C_out#4 = CAP_ALU_MAL214699108E3: CAP - ALU 470uF 20% 50V - 1616; Current: 1.3A; Mfg: Vishay Dale; Mfg Part Number: MAL214699108E3; HelpURL: http://www.vishay.com/docs/28403/146cti.pdf; CreatedBy: Jonathan Bouchard; Temperature: -55°C to 125°C; Power: *; Supplier 1: Digikey; Supplier Part Number 1: 4442PHCT-ND
CN9-CN12 = CMP-002-00061-3: Disconnectable Crimp Style Connector, Pitch 1.25 mm, 1 x 2 Position, Height 4.05 mm, -25 to 85 degC, RoHS, Tape and Reel; Connector Type: Header,Shrouded; Mounting Technology: SurfaceMount; Case/Package: Disconnectable Crimp Style Connector, Pitch 1.25 mm, 1 x 2 Position, Height 4.05 mm; Pins: 4
D28#4 D46 D51 D52 = LED_SML-311DTT86: LED - 611nM ORANGE 2mA - 0603; Voltage: 1.8V; Mfg: ROHM Semiconductor; Power: 44mW; Current: 2mA; HelpURL: http://media.digikey.com/pdf/Data%20Sheets/Rohm%20PDFs/SML-311%20Series.pdf; CreatedBy: Jonathan Bouchard; Temperature: -40°C to 85°C; Package: 0603; Precision: *; Mfg Part Number: SML-311DTT86; Supplier 1: Digikey; Supplier Part Number 1: 511-1303-1-ND
D42-D45 D47-D50 = TVS_PWR_SMBJ24CA: TVS - 24V 26.7V 600W - DO214AA; Manufacturer #1: Littelfuse Inc.; Value: Vbr = 26.7V -  Clamp = 38.9V; Voltage Rating: 24V Standoff; Current Rating: 15.5A; GRAMS Lib Spec: 2.8; Magnetic Material: UNKNOWN; Polarized: NO; Tolerance: *; Power Max: 600W; HelpURL: http://www.littelfuse.com/~/media/electronics/datasheets/tvs_diodes/littelfuse_tvs_diode_smbj_datasheet.pdf.pdf; CreatedBy/Date: Arnaud Samson - 06/07/18; VerifiedBy: Jonathan Bouchard - 2018-07-13; Temperature: -65°C ~ 150°C (TJ); Package: DO214AA; Manufacturer #2: *; Note: *; Assembly Type: SMD; Part Number #2: *; Part Number #1: SMBJ24CA; Supplier 1: Digi-Key; Supplier Part Number 1: SMBJ24CALFCT-ND; Cryo: UNKNOWN
DZ8-DZ10 DZ#4 = MMSZ5254B-7-F: DIODE ZENER 27V 500MW SOD123 MMSZ5254B-7-F; Mfr_Name: Diodes Inc
U16#4 U26-U28 = TPS26400RHFR: No Description Available; Mfr_Name: Texas Instruments; TYPE: TYPE; RefDes: RefDes
R97-R113 R121-R123 = RES - 0603: Current: *; CreatedBy: Jonathan Bouchard

## Sheet REGENIX_Relais_24V_4.SchDoc
size Tabloid; Date: Date; Author: Author 1; DocumentNumber: 2; Revision: 1; SheetNumber: 17; SheetTotal: 17; Size: 11x17; Sheet_Name: BATTERY PROTECTION & AUXILIARY
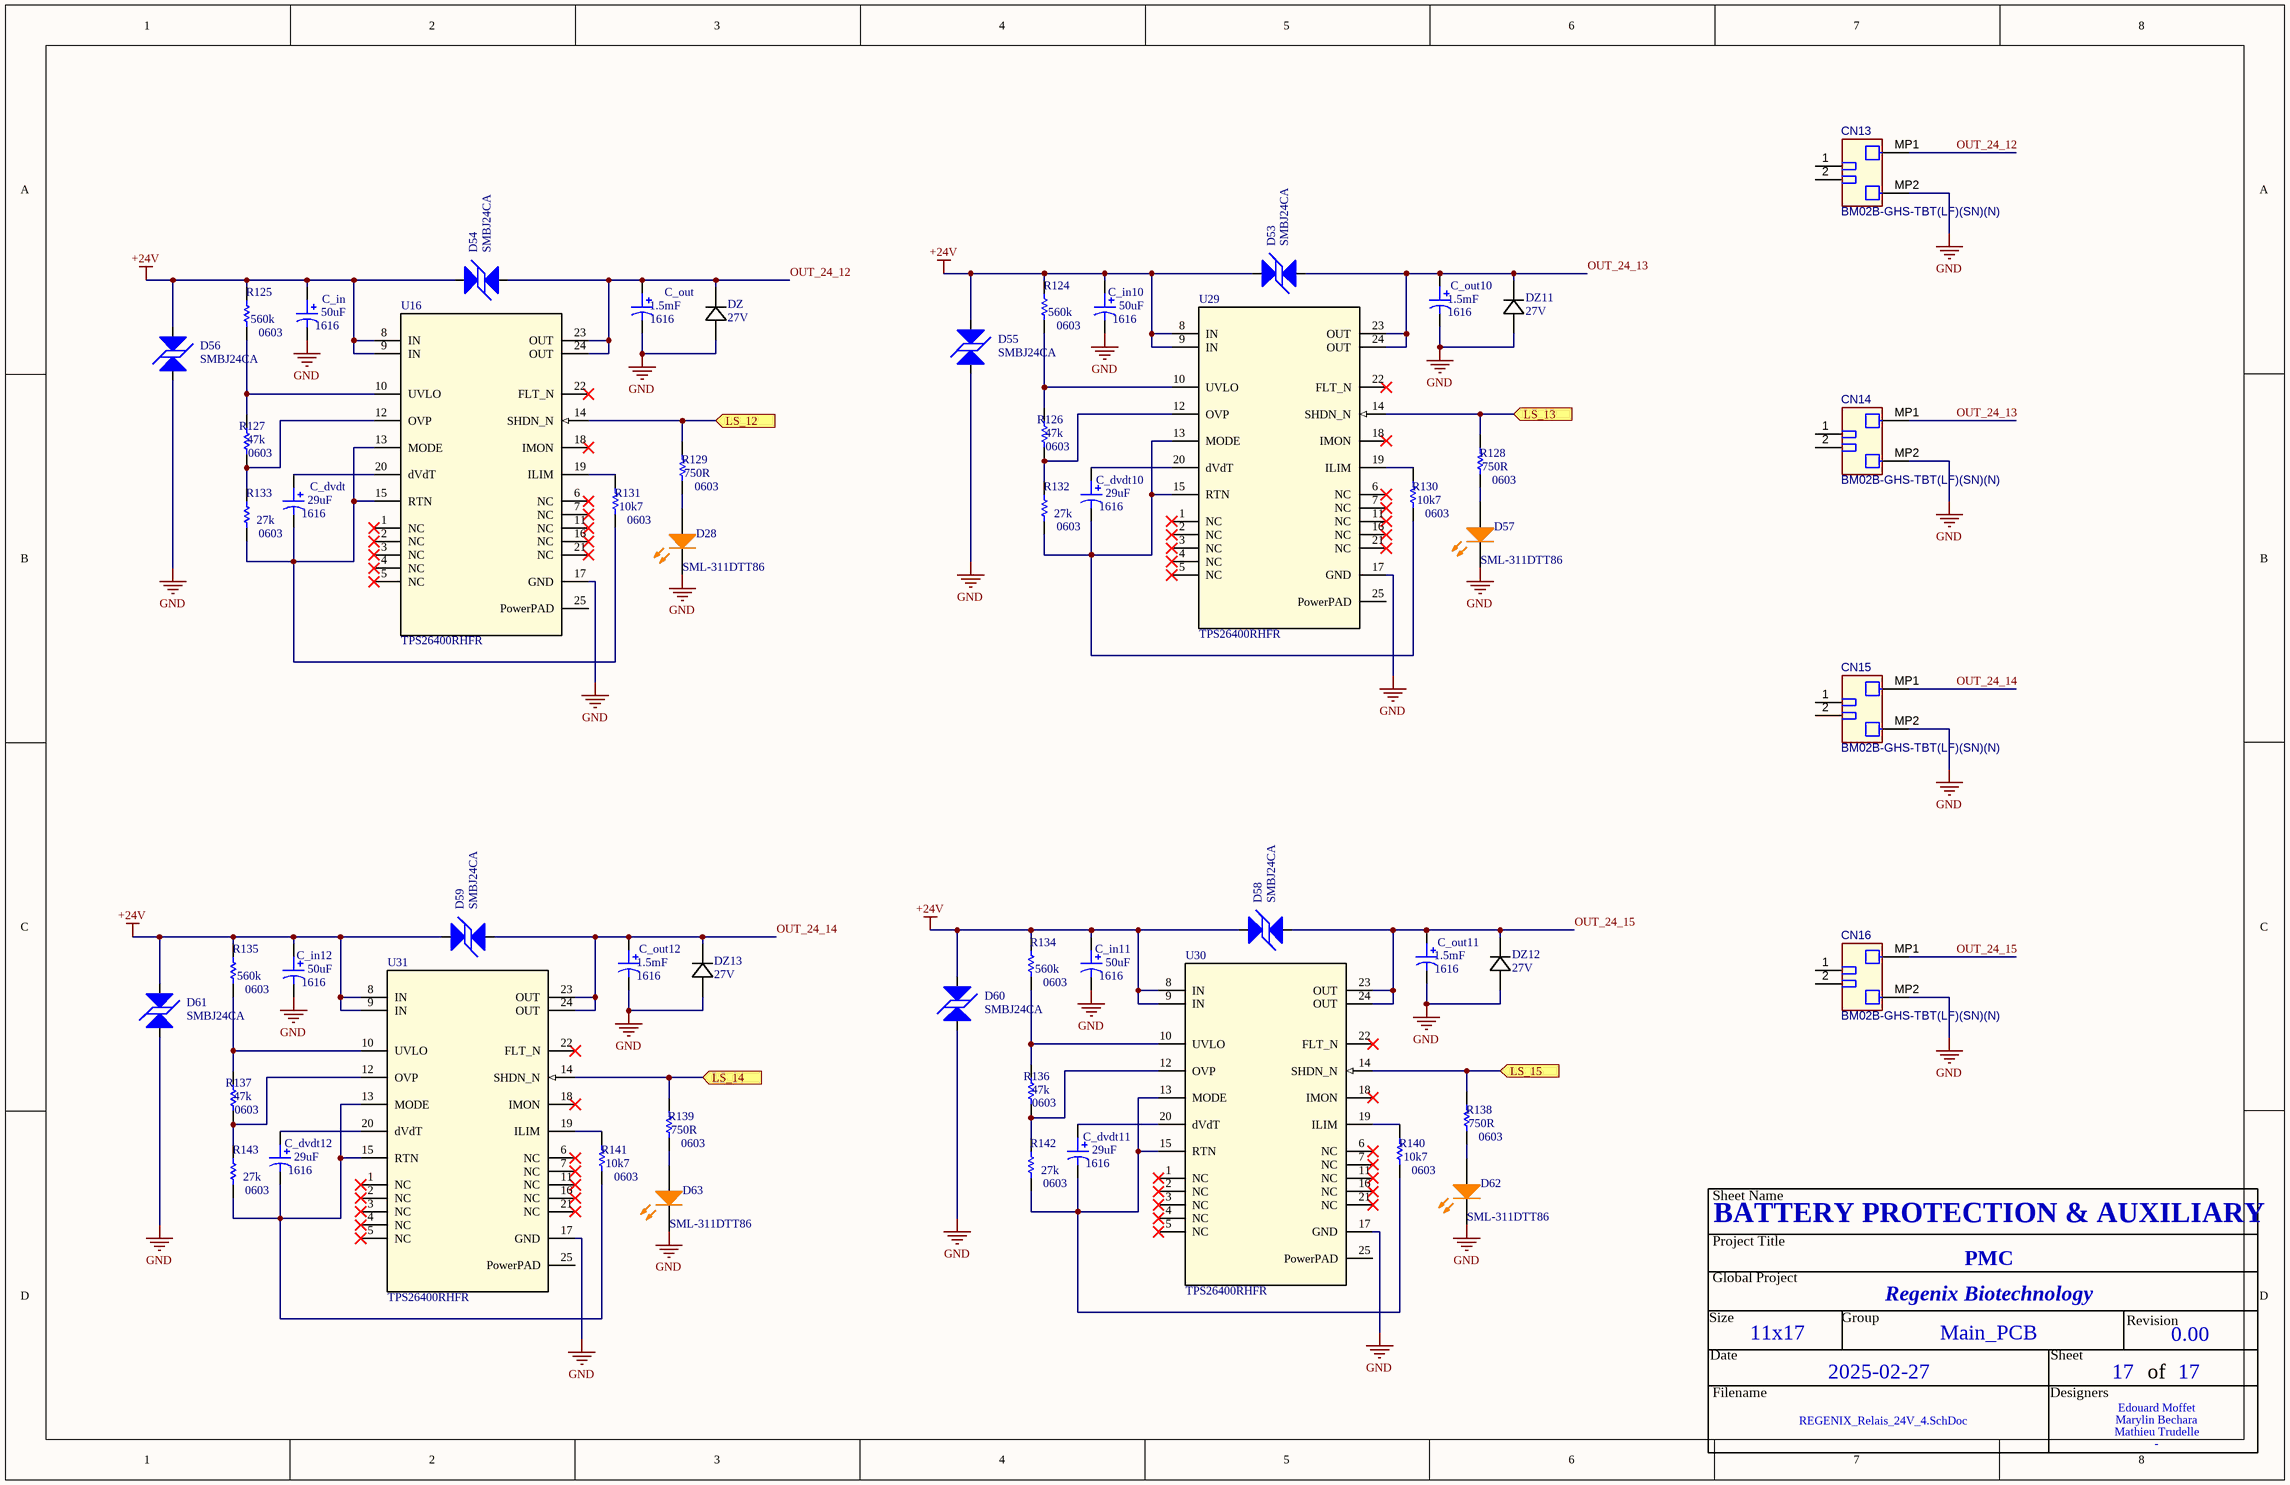
[diagram p14: REGENIX_Relais_24V_4.SchDoc]

### Parts
(Parts that share a designator on the sheet are numbered #1, #2 ... from top to bottom, then left to right.)
C_dvdt10  value 29uF  Package: 1616  [CAP_ALU_1616_vishay]  (hidden comment: MAL214699108E3)
C_dvdt11  value 29uF  Package: 1616  [CAP_ALU_1616_vishay]  (hidden comment: MAL214699108E3)
C_dvdt12  value 29uF  Package: 1616  [CAP_ALU_1616_vishay]  (hidden comment: MAL214699108E3)
C_dvdt#5  value 29uF  Package: 1616  [CAP_ALU_1616_vishay]  (hidden comment: MAL214699108E3)
C_in10  value 50uF  Package: 1616  [CAP_ALU_1616_vishay]  (hidden comment: MAL214699108E3)
C_in11  value 50uF  Package: 1616  [CAP_ALU_1616_vishay]  (hidden comment: MAL214699108E3)
C_in12  value 50uF  Package: 1616  [CAP_ALU_1616_vishay]  (hidden comment: MAL214699108E3)
C_in#5  value 50uF  Package: 1616  [CAP_ALU_1616_vishay]  (hidden comment: MAL214699108E3)
C_out10  value 1.5mF  Package: 1616  [CAP_ALU_1616_vishay]  (hidden comment: MAL214699108E3)
C_out11  value 1.5mF  Package: 1616  [CAP_ALU_1616_vishay]  (hidden comment: MAL214699108E3)
C_out12  value 1.5mF  Package: 1616  [CAP_ALU_1616_vishay]  (hidden comment: MAL214699108E3)
C_out#5  value 1.5mF  Package: 1616  [CAP_ALU_1616_vishay]  (hidden comment: MAL214699108E3)
CN13  BM02B-GHS-TBT(LF)(SN)(N)  [JST-BM02B-GHS-TBT_V]
CN14  BM02B-GHS-TBT(LF)(SN)(N)  [JST-BM02B-GHS-TBT_V]
CN15  BM02B-GHS-TBT(LF)(SN)(N)  [JST-BM02B-GHS-TBT_V]
CN16  BM02B-GHS-TBT(LF)(SN)(N)  [JST-BM02B-GHS-TBT_V]
D28#5  SML-311DTT86  [LED_0603]
D53  SMBJ24CA  [TVS_PWR_SMBJ36CA]
D54  SMBJ24CA  [TVS_PWR_SMBJ36CA]
D55  SMBJ24CA  [TVS_PWR_SMBJ36CA]
D56  SMBJ24CA  [TVS_PWR_SMBJ36CA]
D57  SML-311DTT86  [LED_0603]
D58  SMBJ24CA  [TVS_PWR_SMBJ36CA]
D59  SMBJ24CA  [TVS_PWR_SMBJ36CA]
D60  SMBJ24CA  [TVS_PWR_SMBJ36CA]
D61  SMBJ24CA  [TVS_PWR_SMBJ36CA]
D62  SML-311DTT86  [LED_0603]
D63  SML-311DTT86  [LED_0603]
DZ11  27V  [SOD123_DIO]
DZ12  27V  [SOD123_DIO]
DZ13  27V  [SOD123_DIO]
DZ#5  27V  [SOD123_DIO]
R124  Package: 0603  Precision: 560k  [RES_0603]  (hidden comment: RES - 0603)
R125  Package: 0603  Precision: 560k  [RES_0603]  (hidden comment: RES - 0603)
R126  Package: 0603  Precision: 47k  [RES_0603]  (hidden comment: RES - 0603)
R127  Package: 0603  Precision: 47k  [RES_0603]  (hidden comment: RES - 0603)
R128  Package: 0603  Precision: 750R  [RES_0603]  (hidden comment: RES - 0603)
R129  Package: 0603  Precision: 750R  [RES_0603]  (hidden comment: RES - 0603)
R130  Package: 0603  Precision: 10k7  [RES_0603]  (hidden comment: RES - 0603)
R131  Package: 0603  Precision: 10k7  [RES_0603]  (hidden comment: RES - 0603)
R132  Package: 0603  Precision: 27k  [RES_0603]  (hidden comment: RES - 0603)
R133  Package: 0603  Precision: 27k  [RES_0603]  (hidden comment: RES - 0603)
R134  Package: 0603  Precision: 560k  [RES_0603]  (hidden comment: RES - 0603)
R135  Package: 0603  Precision: 560k  [RES_0603]  (hidden comment: RES - 0603)
R136  Package: 0603  Precision: 47k  [RES_0603]  (hidden comment: RES - 0603)
R137  Package: 0603  Precision: 47k  [RES_0603]  (hidden comment: RES - 0603)
R138  Package: 0603  Precision: 750R  [RES_0603]  (hidden comment: RES - 0603)
R139  Package: 0603  Precision: 750R  [RES_0603]  (hidden comment: RES - 0603)
R140  Package: 0603  Precision: 10k7  [RES_0603]  (hidden comment: RES - 0603)
R141  Package: 0603  Precision: 10k7  [RES_0603]  (hidden comment: RES - 0603)
R142  Package: 0603  Precision: 27k  [RES_0603]  (hidden comment: RES - 0603)
R143  Package: 0603  Precision: 27k  [RES_0603]  (hidden comment: RES - 0603)
U16#5  TPS26400RHFR  [RHF0024A-IPC_A]
U29  TPS26400RHFR  [RHF0024A-IPC_A]
U30  TPS26400RHFR  [RHF0024A-IPC_A]
U31  TPS26400RHFR  [RHF0024A-IPC_A]

### Ports
LS_12 (in), LS_13 (in), LS_14 (in), LS_15 (in)

### Nets
+24V: C_in10.1 C_in11.1 C_in12.1 C_in#5.1 D53.1 D54.1 D55.1 D56.1 D58.1 D59.1 D60.1 D61.1 R124.2 R125.2 R134.2 R135.2 U16#5.8(IN) U16#5.9(IN) U29.8(IN) U29.9(IN) U30.8(IN) U30.9(IN) U31.8(IN) U31.9(IN)
GND: C_in10.2 C_in11.2 C_in12.2 C_in#5.2 C_out10.2 C_out11.2 C_out12.2 C_out#5.2 CN13.MP2 CN14.MP2 CN15.MP2 CN16.MP2 D28#5.K D55.2 D56.2 D57.K D60.2 D61.2 D62.K D63.K DZ11.2 DZ12.2 DZ13.2 DZ#5.2 U16#5.17(GND) U29.17(GND) U30.17(GND) U31.17(GND)
LS_12: R129.2 U16#5.14(SHDN_N) ; port LS_12
LS_13: R128.2 U29.14(SHDN_N) ; port LS_13
LS_14: R139.2 U31.14(SHDN_N) ; port LS_14
LS_15: R138.2 U30.14(SHDN_N) ; port LS_15
OUT_24_12: C_out#5.1 CN13.MP1 D54.2 DZ#5.1 U16#5.23(OUT) U16#5.24(OUT)
OUT_24_13: C_out10.1 CN14.MP1 D53.2 DZ11.1 U29.23(OUT) U29.24(OUT)
OUT_24_14: C_out12.1 CN15.MP1 D59.2 DZ13.1 U31.23(OUT) U31.24(OUT)
OUT_24_15: C_out11.1 CN16.MP1 D58.2 DZ12.1 U30.23(OUT) U30.24(OUT)
NetC_dvdt10_1: C_dvdt10.1 U29.20(dVdT)
NetC_dvdt10_2: C_dvdt10.2 R130.1 R132.1 U29.13(MODE) U29.15(RTN)
NetC_dvdt11_1: C_dvdt11.1 U30.20(dVdT)
NetC_dvdt11_2: C_dvdt11.2 R140.1 R142.1 U30.13(MODE) U30.15(RTN)
NetC_dvdt12_1: C_dvdt12.1 U31.20(dVdT)
NetC_dvdt12_2: C_dvdt12.2 R141.1 R143.1 U31.13(MODE) U31.15(RTN)
NetC_dvdt#5_1: C_dvdt#5.1 U16#5.20(dVdT)
NetC_dvdt#5_2: C_dvdt#5.2 R131.1 R133.1 U16#5.13(MODE) U16#5.15(RTN)
NetD28#5_A: D28#5.A R129.1
NetD57_A: D57.A R128.1
NetD62_A: D62.A R138.1
NetD63_A: D63.A R139.1
NetR124_1: R124.1 R126.2 U29.10(UVLO)
NetR125_1: R125.1 R127.2 U16#5.10(UVLO)
NetR126_1: R126.1 R132.2 U29.12(OVP)
NetR127_1: R127.1 R133.2 U16#5.12(OVP)
NetR130_2: R130.2 U29.19(ILIM)
NetR131_2: R131.2 U16#5.19(ILIM)
NetR134_1: R134.1 R136.2 U30.10(UVLO)
NetR135_1: R135.1 R137.2 U31.10(UVLO)
NetR136_1: R136.1 R142.2 U30.12(OVP)
NetR137_1: R137.1 R143.2 U31.12(OVP)
NetR140_2: R140.2 U30.19(ILIM)
NetR141_2: R141.2 U31.19(ILIM)

Not connected (* = marked no-connect by the designer): CN13 1 2; CN14 1 2; CN15 1 2; CN16 1 2; U16#5 1(NC)* 2(NC)* 3(NC)* 4(NC)* 5(NC)* 6(NC)* 7(NC)* 11(NC)* 16(NC)* 18(IMON)* 21(NC)* 22(FLT_N)* 25(PowerPAD); U29 1(NC)* 2(NC)* 3(NC)* 4(NC)* 5(NC)* 6(NC)* 7(NC)* 11(NC)* 16(NC)* 18(IMON)* 21(NC)* 22(FLT_N)* 25(PowerPAD); U30 1(NC)* 2(NC)* 3(NC)* 4(NC)* 5(NC)* 6(NC)* 7(NC)* 11(NC)* 16(NC)* 18(IMON)* 21(NC)* 22(FLT_N)* 25(PowerPAD); U31 1(NC)* 2(NC)* 3(NC)* 4(NC)* 5(NC)* 6(NC)* 7(NC)* 11(NC)* 16(NC)* 18(IMON)* 21(NC)* 22(FLT_N)* 25(PowerPAD)

### Notes on the sheet
- Sheet Name
- Project Title
- Global Project
- Revision
- Size
- Date
- Group
- Sheet
- of
- Filename
- Designers

### Library data of the parts
C_dvdt10-C_dvdt12 C_dvdt#5 C_in10-C_in12 C_in#5 C_out10-C_out12 C_out#5 = CAP_ALU_MAL214699108E3: as C_dvdt7-C_dvdt9 on sheet REGENIX_Relais_24V_3; Mfg Part Number: MAL214699108E3; HelpURL: http://www.vishay.com/docs/28403/146cti.pdf; CreatedBy: Jonathan Bouchard; Temperature: -55°C to 125°C; Power: *; Supplier 1: Digikey; Supplier Part Number 1: 4442PHCT-ND
CN13-CN16 = CMP-002-00061-3: as CN9-CN12 on sheet REGENIX_Relais_24V_3; Mounting Technology: SurfaceMount; Case/Package: Disconnectable Crimp Style Connector, Pitch 1.25 mm, 1 x 2 Position, Height 4.05 mm; Pins: 4
D28#5 D57 D62 D63 = LED_SML-311DTT86: as D28#4 on sheet REGENIX_Relais_24V_3; Current: 2mA; HelpURL: http://media.digikey.com/pdf/Data%20Sheets/Rohm%20PDFs/SML-311%20Series.pdf; CreatedBy: Jonathan Bouchard; Temperature: -40°C to 85°C; Package: 0603; Precision: *; Mfg Part Number: SML-311DTT86; Supplier 1: Digikey; Supplier Part Number 1: 511-1303-1-ND
D53-D56 D58-D61 = TVS_PWR_SMBJ24CA: as D42-D45 on sheet REGENIX_Relais_24V_3; Tolerance: *; Power Max: 600W; HelpURL: http://www.littelfuse.com/~/media/electronics/datasheets/tvs_diodes/littelfuse_tvs_diode_smbj_datasheet.pdf.pdf; CreatedBy/Date: Arnaud Samson - 06/07/18; VerifiedBy: Jonathan Bouchard - 2018-07-13; Temperature: -65°C ~ 150°C (TJ); Package: DO214AA; Manufacturer #2: *; Note: *; Assembly Type: SMD; Part Number #2: *; Part Number #1: SMBJ24CA; Supplier 1: Digi-Key; Supplier Part Number 1: SMBJ24CALFCT-ND; Cryo: UNKNOWN
DZ11-DZ13 DZ#5 = MMSZ5254B-7-F: as DZ8-DZ10 on sheet REGENIX_Relais_24V_3
U16#5 U29-U31 = TPS26400RHFR: as U16#4 on sheet REGENIX_Relais_24V_3; TYPE: TYPE; RefDes: RefDes
R124-R143 = RES - 0603: Current: *; CreatedBy: Jonathan Bouchard

## Nets that join several sheets
3V3: REGENIX_Battery_Protection (R116.2 R119.2 U23.3 U24.3), REGENIX_RS485 (C7.2 U3.1), REGENIX_I2C (17 pins), REGENIX_USB-C (C2.2 U8.10 U8.16)
5V: REGENIX_RS485 (7 pins), REGENIX_I2C (C10.2 U4.1)
+24V: REGENIX_Relais_12V (6 pins), REGENIX_Convertisseurs (U19.2), REGENIX_Relais_24V_1 (24 pins), REGENIX_Relais_24V_2 (24 pins), REGENIX_Relais_24V_3 (24 pins), REGENIX_Relais_24V_4 (24 pins)
GND: REGENIX_TITLE (MTH1.1 MTH2.1 MTH3.1 MTH4.1), REGENIX_Battery_Protection (14 pins), REGENIX_RS485 (5 pins), REGENIX_I2C (21 pins), REGENIX_Relais_12V (14 pins), REGENIX_USB-C (C2.1 U8.9 U8.15), REGENIX_ESP32 (19 pins), REGENIX_DRIVER (22 pins), REGENIX_Convertisseurs (R36.1 U19.1 U19.7), REGENIX_DRIVER_2 (26 pins), REGENIX_DRIVER_3 (26 pins), REGENIX_Relais_24V_1 (30 pins), REGENIX_Relais_24V_2 (31 pins), REGENIX_Relais_24V_3 (28 pins), REGENIX_Relais_24V_4 (28 pins)
VM: REGENIX_DRIVER (10 pins), REGENIX_DRIVER_2 (10 pins), REGENIX_DRIVER_3 (10 pins)
DRIVER_EN: REGENIX_DRIVER (U20.29), REGENIX_DRIVER_2 (U1.29), REGENIX_DRIVER_3 (U12.29)
DRIVER_INT: REGENIX_DRIVER (U20.1), REGENIX_DRIVER_2 (U1.1), REGENIX_DRIVER_3 (U12.1)
DRIVER_PP: REGENIX_DRIVER (U20.2), REGENIX_DRIVER_2 (U1.2), REGENIX_DRIVER_3 (U12.2)
DRIVER_REFL1: REGENIX_DRIVER (U20.28), REGENIX_DRIVER_2 (U1.28), REGENIX_DRIVER_3 (U12.28)
DRIVER_REFL2: REGENIX_DRIVER (U20.26), REGENIX_DRIVER_2 (U1.26), REGENIX_DRIVER_3 (U12.26)
DRIVER_REFR1: REGENIX_DRIVER (U20.27), REGENIX_DRIVER_2 (U1.27), REGENIX_DRIVER_3 (U12.27)
DRIVER_REFR2: REGENIX_DRIVER (U20.25), REGENIX_DRIVER_2 (U1.25), REGENIX_DRIVER_3 (U12.25)
DRIVER_SCK: REGENIX_DRIVER (U20.4), REGENIX_DRIVER_2 (U1.4), REGENIX_DRIVER_3 (U12.4)
DRIVER_SDI: REGENIX_DRIVER (U20.5), REGENIX_DRIVER_2 (U1.5), REGENIX_DRIVER_3 (U12.5)
DRIVER_SDO: REGENIX_DRIVER (U20.8), REGENIX_DRIVER_2 (U1.8), REGENIX_DRIVER_3 (U12.8)
DTR_USB: REGENIX_USB-C (U8.13), REGENIX_ESP32 (Q1.4 R14.2)
ESP_SCL: REGENIX_I2C (R?#6.1 U5.2 U6.2 U7.2), REGENIX_ESP32 (IC2.36)
ESP_SDA: REGENIX_I2C (R?#7.1 U5.3 U6.3 U7.3), REGENIX_ESP32 (IC2.33)
RTS_USB: REGENIX_USB-C (U8.12), REGENIX_ESP32 (Q1.1 R15.2)
UART_USB_IN: REGENIX_USB-C (U8.11), REGENIX_ESP32 (IC2.35)
UART_USB_OUT: REGENIX_USB-C (U8.14), REGENIX_ESP32 (IC2.34)
VCC_IO: REGENIX_DRIVER (C35.2 U20.7), REGENIX_DRIVER_2 (C55.2 U1.7), REGENIX_DRIVER_3 (C64.2 U12.7)